# Altium project DB_Memory.PrjPCB (part 2 of 2)
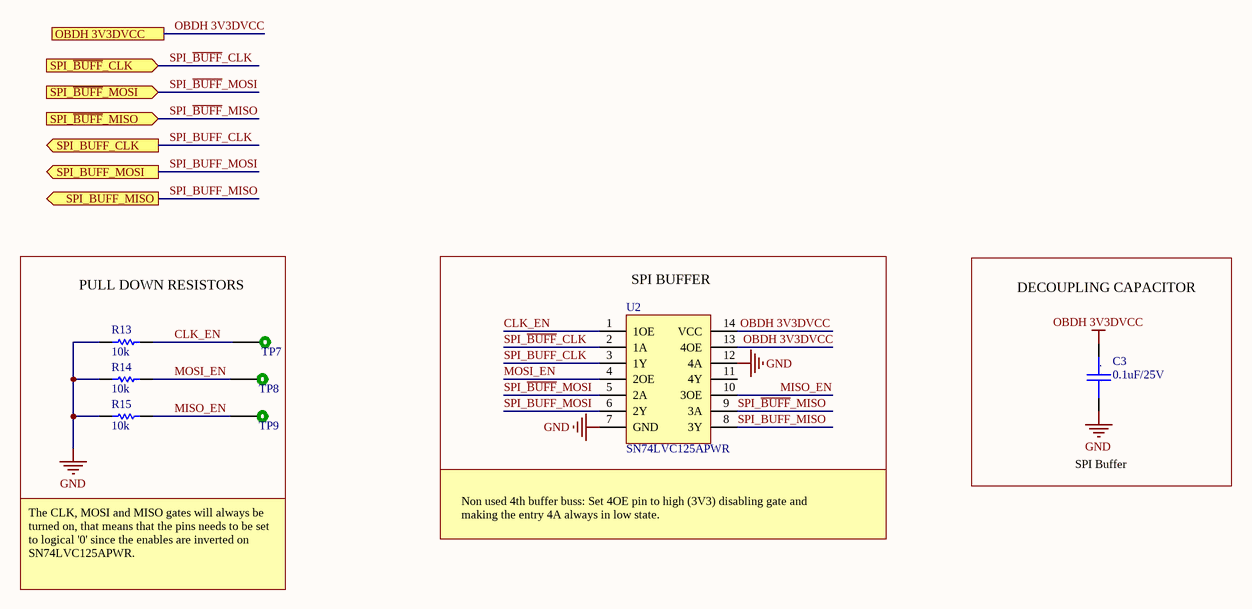
[diagram p4: 3_Communication_Buffers.SchDoc]

## Nets that join several sheets
GND: 0_Architecture (M4.0), 1_Interface (5 pins), 2_Non_Volatile_Memories (6 pins), 3_Communication_Buffers (6 pins)
OBDH 3V3DVCC: 1_Interface (J_V1.2 P1.1), 2_Non_Volatile_Memories (14 pins), 3_Communication_Buffers (C3.1 U2.13 U2.14)
D BOARD GPIO0: 1_Interface (P1.7), 2_Non_Volatile_Memories (R5.1 TP4.1 U1.3)
D BOARD GPIO1: 1_Interface (P1.8), 2_Non_Volatile_Memories (R4.1 TP3.1 U1.1)
D BOARD GPIO2: 1_Interface (P1.9), 2_Non_Volatile_Memories (R3.1 TP2.1 U1.9)
D BOARD SPI CS0: 1_Interface (P1.17), 2_Non_Volatile_Memories (J_V3.2 TP6.1)
D BOARD SPI CS1: 1_Interface (P1.19), 2_Non_Volatile_Memories (J_V2.2 R2.1 TP1.1)
SPI CLK: 1_Interface (P1.11 P2.1), 3_Communication_Buffers (U2.2)
SPI MISO: 1_Interface (P1.13 P2.2), 3_Communication_Buffers (U2.9)
SPI MOSI: 1_Interface (P1.15 P2.3), 3_Communication_Buffers (U2.5)
SPI_BUFF_CLK: 1_Interface (P3.1), 2_Non_Volatile_Memories (5 pins), 3_Communication_Buffers (U2.3)
SPI_BUFF_MISO: 1_Interface (P3.2), 2_Non_Volatile_Memories (R8.1 SC1.7 U1.8), 3_Communication_Buffers (U2.8)
SPI_BUFF_MOSI: 1_Interface (P3.3), 2_Non_Volatile_Memories (R9.1 SC1.5 U1.15), 3_Communication_Buffers (U2.6)